# EAGLE design swizzle (EAGLE 6.6.0)
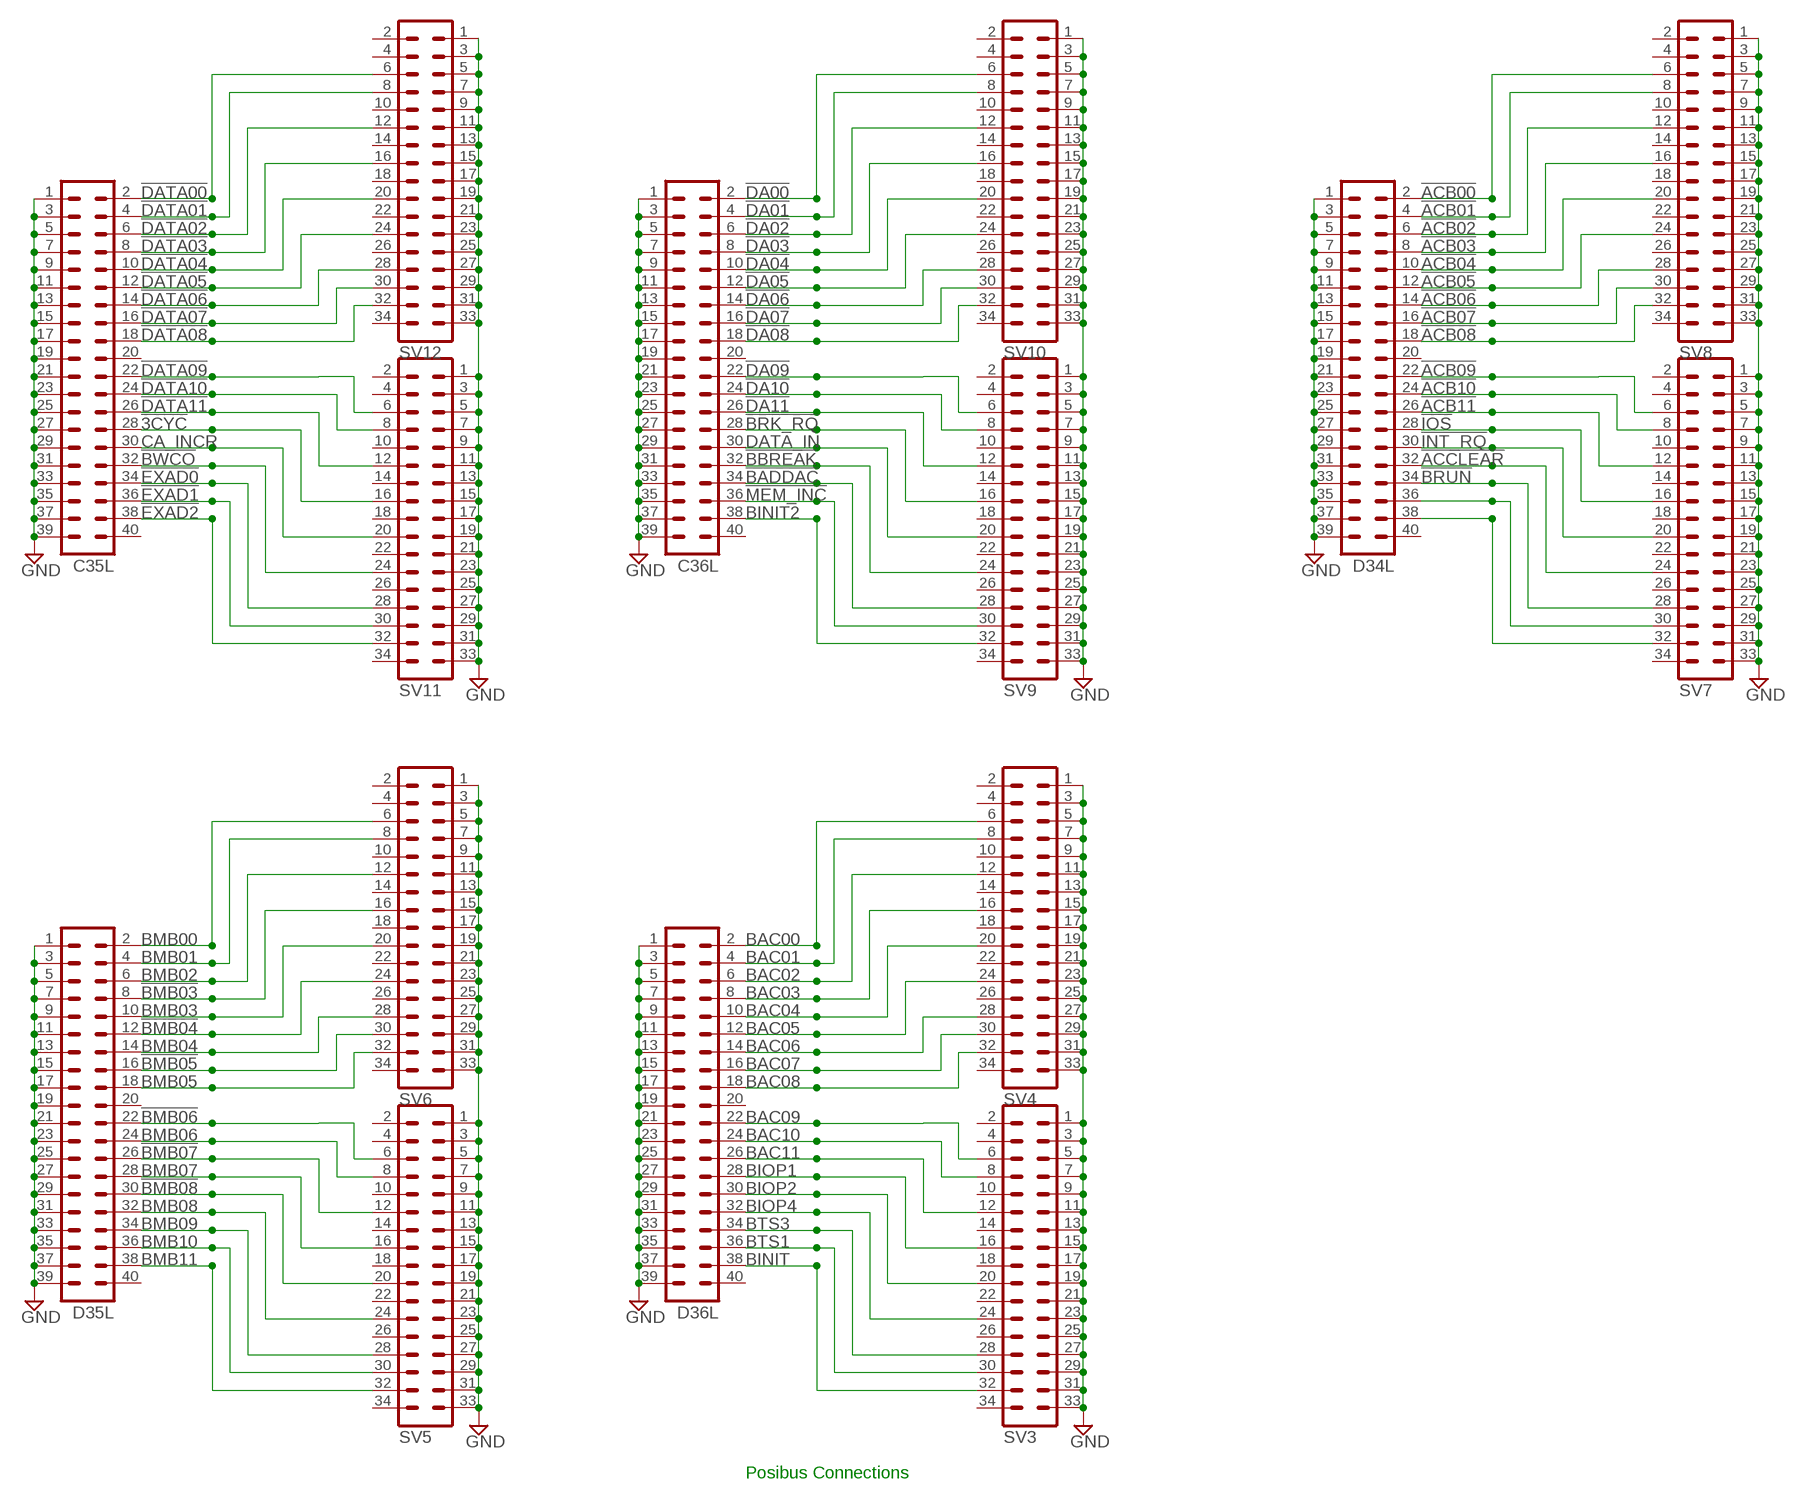
[diagram p0: schematic, sheet 1]

## Parts
C35L  MA20-2  [MA20-2]
C36L  MA20-2  [MA20-2]
D34L  MA20-2  [MA20-2]
D35L  MA20-2  [MA20-2]
D36L  MA20-2  [MA20-2]
SV3  MA17-2  [MA17-2]
SV4  MA17-2  [MA17-2]
SV5  MA17-2  [MA17-2]
SV6  MA17-2  [MA17-2]
SV7  MA17-2  [MA17-2]
SV8  MA17-2  [MA17-2]
SV9  MA17-2  [MA17-2]
SV10  MA17-2  [MA17-2]
SV11  MA17-2  [MA17-2]
SV12  MA17-2  [MA17-2]

## Nets
!3CYC: C35L.28 SV11.16
!ACB00: D34L.2 SV8.6
!ACB01: D34L.4 SV8.8
!ACB02: D34L.6 SV8.12
!ACB03: D34L.8 SV8.16
!ACB04: D34L.10 SV8.20
!ACB05: D34L.12 SV8.24
!ACB06: D34L.14 SV8.28
!ACB07: D34L.16 SV8.30
!ACB08: D34L.18 SV8.32
!ACB09: D34L.22 SV7.6
!ACB10: D34L.24 SV7.8
!ACB11: D34L.26 SV7.12
!ACCLEAR: D34L.32 SV7.24
!BADDAC: C36L.34 SV9.28
!BBREAK: C36L.32 SV9.24
!BMB03: D35L.8 SV6.16
!BMB04: D35L.12 SV6.24
!BMB05: D35L.16 SV6.30
!BMB06: D35L.22 SV5.6
!BMB07: D35L.26 SV5.12
!BMB08: D35L.30 SV5.20
!BRK_RQ: C36L.28 SV9.16
!BRUN: D34L.34 SV7.28
!BWCO: C35L.32 SV11.24
!DA00: C36L.2 SV10.6
!DA01: C36L.4 SV10.8
!DA02: C36L.6 SV10.12
!DA03: C36L.8 SV10.16
!DA04: C36L.10 SV10.20
!DA05: C36L.12 SV10.24
!DA06: C36L.14 SV10.28
!DA07: C36L.16 SV10.30
!DA08: C36L.18 SV10.32
!DA09: C36L.22 SV9.6
!DA10: C36L.24 SV9.8
!DA11: C36L.26 SV9.12
!DATA00: C35L.2 SV12.6
!DATA01: C35L.4 SV12.8
!DATA02: C35L.6 SV12.12
!DATA03: C35L.8 SV12.16
!DATA04: C35L.10 SV12.20
!DATA05: C35L.12 SV12.24
!DATA06: C35L.14 SV12.28
!DATA07: C35L.16 SV12.30
!DATA08: C35L.18 SV12.32
!DATA09: C35L.22 SV11.6
!DATA10: C35L.24 SV11.8
!DATA11: C35L.26 SV11.12
!EXAD0: C35L.34 SV11.28
!EXAD1: C35L.36 SV11.30
!EXAD2: C35L.38 SV11.32
!INT_RQ: D34L.30 SV7.20
!IOS: D34L.28 SV7.16
!MEM_INC: C36L.36 SV9.30
BAC00: D36L.2 SV4.6
BAC01: D36L.4 SV4.8
BAC02: D36L.6 SV4.12
BAC03: D36L.8 SV4.16
BAC04: D36L.10 SV4.20
BAC05: D36L.12 SV4.24
BAC06: D36L.14 SV4.28
BAC07: D36L.16 SV4.30
BAC08: D36L.18 SV4.32
BAC09: D36L.22 SV3.6
BAC10: D36L.24 SV3.8
BAC11: D36L.26 SV3.12
BINIT: D36L.38 SV3.32
BINIT2: C36L.38 SV9.32
BIOP1: D36L.28 SV3.16
BIOP2: D36L.30 SV3.20
BIOP4: D36L.32 SV3.24
BMB00: D35L.2 SV6.6
BMB01: D35L.4 SV6.8
BMB02: D35L.6 SV6.12
BMB03: D35L.10 SV6.20
BMB04: D35L.14 SV6.28
BMB05: D35L.18 SV6.32
BMB06: D35L.24 SV5.8
BMB07: D35L.28 SV5.16
BMB08: D35L.32 SV5.24
BMB09: D35L.34 SV5.28
BMB10: D35L.36 SV5.30
BMB11: D35L.38 SV5.32
BTS1: D36L.36 SV3.30
BTS3: D36L.34 SV3.28
CA_INCR: C35L.30 SV11.20
DATA_IN: C36L.30 SV9.20
GND: C35L.1 C35L.3 C35L.5 C35L.7 C35L.9 C35L.11 C35L.13 C35L.15 C35L.17 C35L.19 C35L.21 C35L.23 C35L.25 C35L.27 C35L.29 C35L.31 C35L.33 C35L.35 C35L.37 C35L.39 C36L.1 C36L.3 C36L.5 C36L.7 C36L.9 C36L.11 C36L.13 C36L.15 C36L.17 C36L.19 C36L.21 C36L.23 C36L.25 C36L.27 C36L.29 C36L.31 C36L.33 C36L.35 C36L.37 C36L.39 D34L.1 D34L.3 D34L.5 D34L.7 D34L.9 D34L.11 D34L.13 D34L.15 D34L.17 D34L.19 D34L.21 D34L.23 D34L.25 D34L.27 D34L.29 D34L.31 D34L.33 D34L.35 D34L.37 D34L.39 D35L.1 D35L.3 D35L.5 D35L.7 D35L.9 D35L.11 D35L.13 D35L.15 D35L.17 D35L.19 D35L.21 D35L.23 D35L.25 D35L.27 D35L.29 D35L.31 D35L.33 D35L.35 D35L.37 D35L.39 D36L.1 D36L.3 D36L.5 D36L.7 D36L.9 D36L.11 D36L.13 D36L.15 D36L.17 D36L.19 D36L.21 D36L.23 D36L.25 D36L.27 D36L.29 D36L.31 D36L.33 D36L.35 D36L.37 D36L.39 SV3.1 SV3.3 SV3.5 SV3.7 SV3.9 SV3.11 SV3.13 SV3.15 SV3.17 SV3.19 SV3.21 SV3.23 SV3.25 SV3.27 SV3.29 SV3.31 SV3.33 SV4.1 SV4.3 SV4.5 SV4.7 SV4.9 SV4.11 SV4.13 SV4.15 SV4.17 SV4.19 SV4.21 SV4.23 SV4.25 SV4.27 SV4.29 SV4.31 SV4.33 SV5.1 SV5.3 SV5.5 SV5.7 SV5.9 SV5.11 SV5.13 SV5.15 SV5.17 SV5.19 SV5.21 SV5.23 SV5.25 SV5.27 SV5.29 SV5.31 SV5.33 SV6.1 SV6.3 SV6.5 SV6.7 SV6.9 SV6.11 SV6.13 SV6.15 SV6.17 SV6.19 SV6.21 SV6.23 SV6.25 SV6.27 SV6.29 SV6.31 SV6.33 SV7.1 SV7.3 SV7.5 SV7.7 SV7.9 SV7.11 SV7.13 SV7.15 SV7.17 SV7.19 SV7.21 SV7.23 SV7.25 SV7.27 SV7.29 SV7.31 SV7.33 SV8.1 SV8.3 SV8.5 SV8.7 SV8.9 SV8.11 SV8.13 SV8.15 SV8.17 SV8.19 SV8.21 SV8.23 SV8.25 SV8.27 SV8.29 SV8.31 SV8.33 SV9.1 SV9.3 SV9.5 SV9.7 SV9.9 SV9.11 SV9.13 SV9.15 SV9.17 SV9.19 SV9.21 SV9.23 SV9.25 SV9.27 SV9.29 SV9.31 SV9.33 SV10.1 SV10.3 SV10.5 SV10.7 SV10.9 SV10.11 SV10.13 SV10.15 SV10.17 SV10.19 SV10.21 SV10.23 SV10.25 SV10.27 SV10.29 SV10.31 SV10.33 SV11.1 SV11.3 SV11.5 SV11.7 SV11.9 SV11.11 SV11.13 SV11.15 SV11.17 SV11.19 SV11.21 SV11.23 SV11.25 SV11.27 SV11.29 SV11.31 SV11.33 SV12.1 SV12.3 SV12.5 SV12.7 SV12.9 SV12.11 SV12.13 SV12.15 SV12.17 SV12.19 SV12.21 SV12.23 SV12.25 SV12.27 SV12.29 SV12.31 SV12.33
N$46: D34L.36 SV7.30
N$47: D34L.38 SV7.32
Unconnected: C35L.20 C35L.40 C36L.20 C36L.40 D34L.20 D34L.40 D35L.20 D35L.40 D36L.20 D36L.40 SV3.2 SV3.4 SV3.10 SV3.14 SV3.18 SV3.22 SV3.26 SV3.34 SV4.2 SV4.4 SV4.10 SV4.14 SV4.18 SV4.22 SV4.26 SV4.34 SV5.2 SV5.4 SV5.10 SV5.14 SV5.18 SV5.22 SV5.26 SV5.34 SV6.2 SV6.4 SV6.10 SV6.14 SV6.18 SV6.22 SV6.26 SV6.34 SV7.2 SV7.4 SV7.10 SV7.14 SV7.18 SV7.22 SV7.26 SV7.34 SV8.2 SV8.4 SV8.10 SV8.14 SV8.18 SV8.22 SV8.26 SV8.34 SV9.2 SV9.4 SV9.10 SV9.14 SV9.18 SV9.22 SV9.26 SV9.34 SV10.2 SV10.4 SV10.10 SV10.14 SV10.18 SV10.22 SV10.26 SV10.34 SV11.2 SV11.4 SV11.10 SV11.14 SV11.18 SV11.22 SV11.26 SV11.34 SV12.2 SV12.4 SV12.10 SV12.14 SV12.18 SV12.22 SV12.26 SV12.34

## Notes on the sheet
- Posibus Connections

## Library data of the parts
C35L C36L D34L D35L D36L = con-lstb:MA20-2: PIN HEADER; OC_FARNELL: unknown; OC_NEWARK: unknown
SV3-SV12 = con-lstb:MA17-2: PIN HEADER; OC_FARNELL: unknown; OC_NEWARK: unknown

## Board
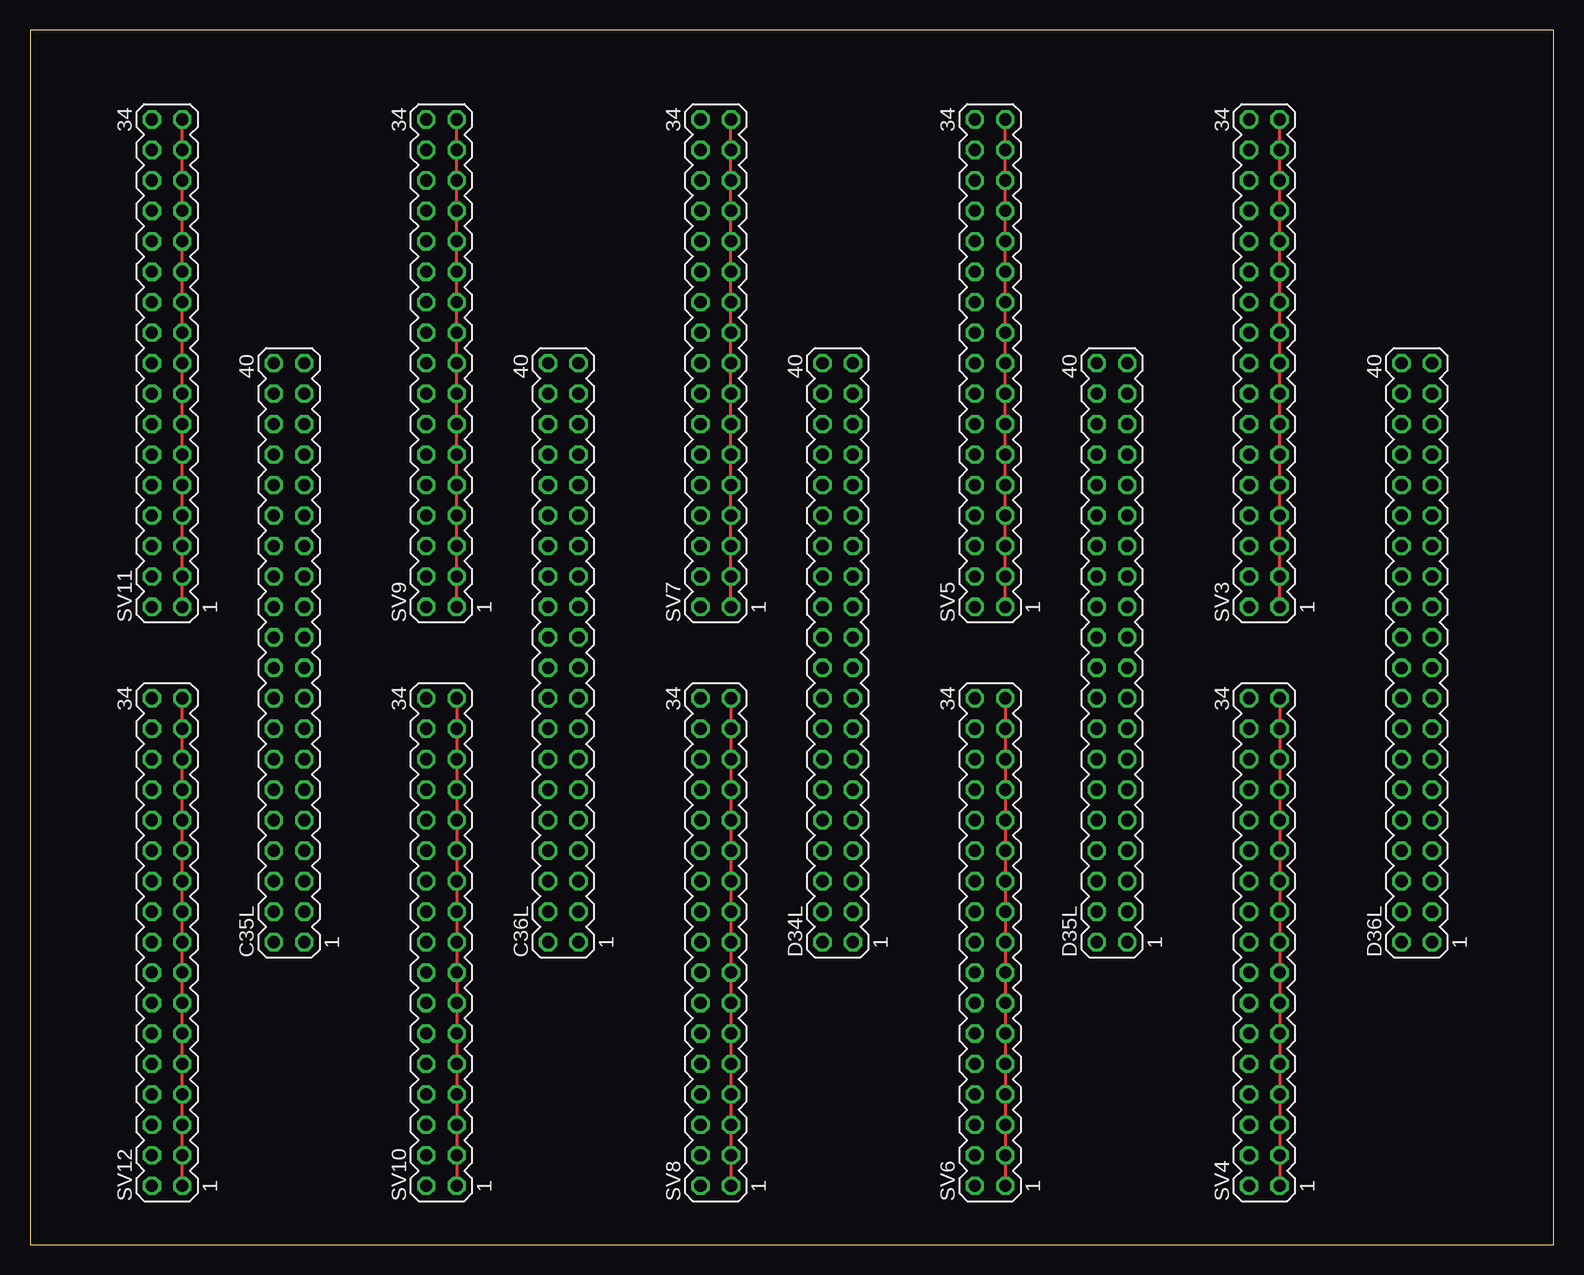
[diagram p1: board, top side]
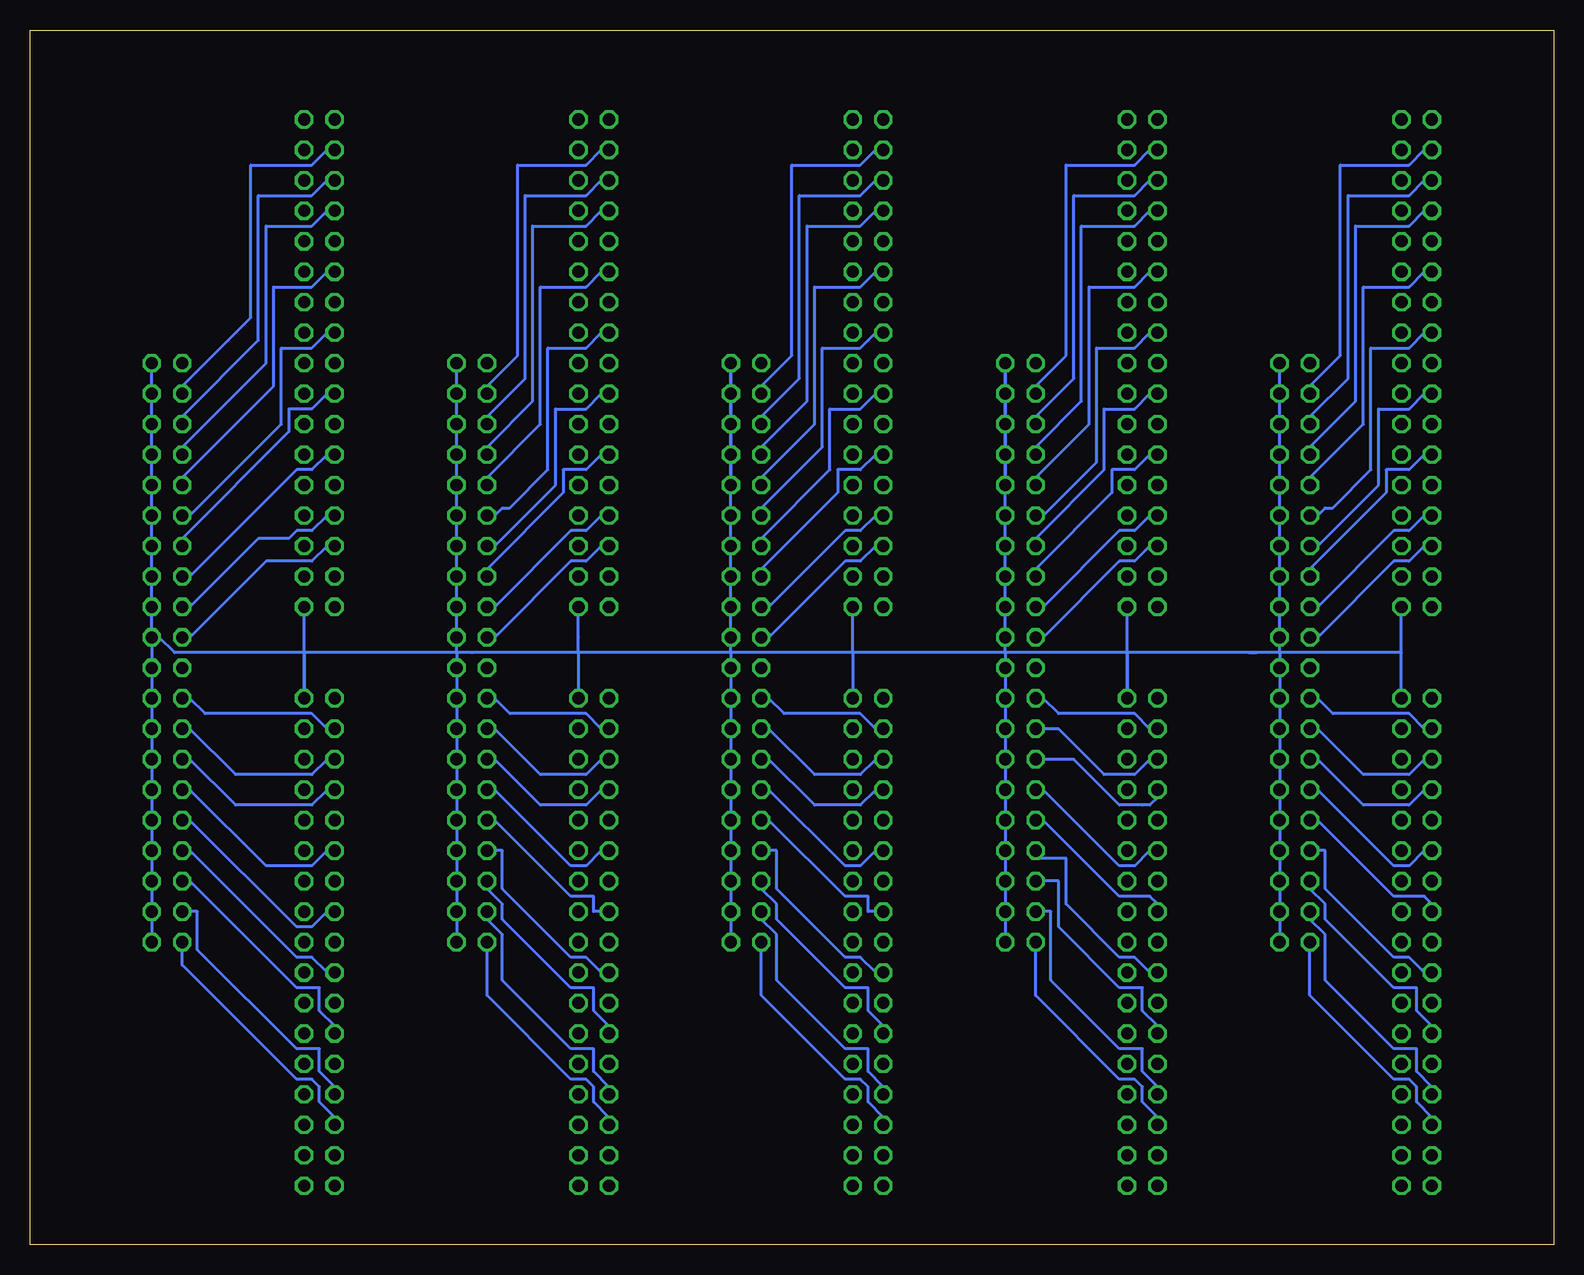
[diagram p2: board, bottom side, seen from below]

Size 126.98 x 101.27 mm. Coordinates in mm from the lower left corner, seen from the top.
Outline: 0,0 126.98,0 126.98,101.27 0,101.27 0,0
Copper layers (1*16): Top 0.035mm / dielectric 1.5mm / Bottom 0.035mm
Design rules "olimex10mil": minimum track width 10mil, minimum drill 24mil, track to track 10mil, track to pad 10mil, pad to pad 10mil, via to via 10mil, smd to smd 10mil, copper to edge 40mil, drill to drill 10mil, minimum pad ring 10mil, minimum via ring 8mil, stop-mask expansion 0mil, vias tented up to drill 0mil, thermal gap 10mil

### Footprints (pad centres in the part's own frame; a part is rotated, then mirrored left to right if it is on the bottom)
MA20-2 = drill 1.016 octagon: 1 -24.13,-1.27; 2 -24.13,1.27; 3 -21.59,-1.27; 4 -21.59,1.27; 5 -19.05,-1.27; 6 -19.05,1.27; 7 -16.51,-1.27; 8 -16.51,1.27; 9 -13.97,-1.27; 10 -13.97,1.27; 11 -11.43,-1.27; 12 -11.43,1.27; 13 -8.89,-1.27; 14 -8.89,1.27; 15 -6.35,-1.27; 16 -6.35,1.27; 17 -3.81,-1.27; 18 -3.81,1.27; 19 -1.27,-1.27; 20 -1.27,1.27; 21 1.27,-1.27; 22 1.27,1.27; 23 3.81,-1.27; 24 3.81,1.27; 25 6.35,-1.27; 26 6.35,1.27; 27 8.89,-1.27; 28 8.89,1.27; 29 11.43,-1.27; 30 11.43,1.27; 31 13.97,-1.27; 32 13.97,1.27; 33 16.51,-1.27; 34 16.51,1.27; 35 19.05,-1.27; 36 19.05,1.27; 37 21.59,-1.27; 38 21.59,1.27; 39 24.13,-1.27; 40 24.13,1.27
MA17-2 = drill 1.016 octagon: 1 -20.32,-1.27; 2 -20.32,1.27; 3 -17.78,-1.27; 4 -17.78,1.27; 5 -15.24,-1.27; 6 -15.24,1.27; 7 -12.7,-1.27; 8 -12.7,1.27; 9 -10.16,-1.27; 10 -10.16,1.27; 11 -7.62,-1.27; 12 -7.62,1.27; 13 -5.08,-1.27; 14 -5.08,1.27; 15 -2.54,-1.27; 16 -2.54,1.27; 17 0,-1.27; 18 0,1.27; 19 2.54,-1.27; 20 2.54,1.27; 21 5.08,-1.27; 22 5.08,1.27; 23 7.62,-1.27; 24 7.62,1.27; 25 10.16,-1.27; 26 10.16,1.27; 27 12.7,-1.27; 28 12.7,1.27; 29 15.24,-1.27; 30 15.24,1.27; 31 17.78,-1.27; 32 17.78,1.27; 33 20.32,-1.27; 34 20.32,1.27

### Placement (x,y rotation side)
C35L  21.59,49.37 90 top
C36L  44.45,49.37 90 top
D34L  67.31,49.37 90 top
D35L  90.17,49.37 90 top
D36L  115.56,49.37 90 top
SV3  102.87,73.49 90 top
SV4  102.87,25.23 90 top
SV5  80.01,73.49 90 top
SV6  80.01,25.23 90 top
SV7  57.14,73.49 90 top
SV8  57.14,25.23 90 top
SV9  34.28,73.49 90 top
SV10  34.28,25.23 90 top
SV11  11.42,73.49 90 top
SV12  11.42,25.23 90 top

### Tracks (layer width: path | path; a pad name or v marks a point on that pad's centre or on a via)
!3CYC
  Bottom 0.254: C35L.28 19.68,58.26 14.6,63.34 14.6,69.68 12.06,69.68 10.79,70.95 SV11.16
!ACB00
  Bottom 0.254: D34L.2 66.04,24.6 66.04,20.79 59.05,13.81 57.78,13.81 57.14,13.17 57.14,11.9 55.88,10.63 SV8.6
!ACB01
  Bottom 0.254: D34L.4 66.04,27.14 64.77,25.87 64.77,22.06 59.05,16.35 57.78,16.35 57.14,16.35 57.14,14.44 55.88,13.17 SV8.8
!ACB02
  Bottom 0.254: SV8.12 55.88,18.25 57.14,19.52 57.14,21.43 59.05,21.43 64.77,27.14 64.77,28.41 66.04,29.68 D34L.6
!ACB03
  Bottom 0.254: SV8.16 56.51,22.7 57.78,23.96 59.05,23.96 64.77,29.68 64.77,32.86 65.4,32.86 D34L.8
!ACB04
  Bottom 0.254: D34L.10 65.4,35.4 59.05,29.05 57.14,29.05 57.14,27.78 56.51,27.78 SV8.20
!ACB05
  Bottom 0.254: D34L.12 65.4,37.94 59.05,31.59 57.78,31.59 56.51,32.86 SV8.24
!ACB06
  Bottom 0.254: D34L.14 65.4,40.48 61.59,36.66 57.78,36.66 56.51,37.94 SV8.28
!ACB07
  Bottom 0.254: D34L.16 65.4,43.02 61.59,39.2 57.78,39.2 56.51,40.48 SV8.30
!ACB08
  Bottom 0.254: SV8.32 56.51,43.02 57.78,44.29 64.13,44.29 65.4,45.55 D34L.18
!ACB09
  Bottom 0.254: SV7.6 56.51,58.26 57.78,56.98 59.05,56.98 65.4,50.63 D34L.22
!ACB10
  Bottom 0.254: SV7.8 56.51,60.8 57.78,59.52 59.05,59.52 65.4,53.18 D34L.24
!ACB11
  Bottom 0.254: D34L.26 66.04,56.35 59.68,62.7 59.68,64.6 57.78,64.6 56.51,65.88 SV7.12
!ACCLEAR
  Bottom 0.254: D34L.32 66.04,63.97 61.59,68.41 61.59,79.84 57.78,79.84 56.51,81.11 SV7.24
!BADDAC
  Bottom 0.254: C36L.34 43.17,66.51 39.36,70.32 39.36,84.92 34.92,84.92 33.65,86.19 SV9.28
!BBREAK
  Bottom 0.254: C36L.32 43.17,63.97 38.73,68.41 38.73,79.84 34.92,79.84 33.65,81.11 SV9.24
!BMB03
  Bottom 0.254: SV6.16 79.37,22.7 80.64,23.96 81.91,23.96 87.62,29.68 87.62,32.86 88.26,32.86 D35L.8
!BMB04
  Bottom 0.254: D35L.12 88.26,37.94 81.91,31.59 80.64,31.59 79.37,32.86 SV6.24
!BMB05
  Bottom 0.254: D35L.16 88.26,43.02 84.45,39.2 80.64,39.2 79.37,40.48 SV6.30
!BMB06
  Bottom 0.254: SV5.6 79.37,58.26 80.64,56.98 81.91,56.98 88.26,50.63 D35L.22
!BMB07
  Bottom 0.254: D35L.26 88.9,56.35 82.55,62.7 82.55,64.6 80.64,64.6 79.37,65.88 SV5.12
!BMB08
  Bottom 0.254: D35L.30 88.26,60.8 87.62,61.43 86.99,61.43 83.81,64.6 83.81,74.77 80.64,74.77 79.37,76.03 SV5.20
!BRK_RQ
  Bottom 0.254: C36L.28 43.17,58.89 37.46,64.6 37.46,69.68 34.92,69.68 33.65,70.95 SV9.16
!BRUN
  Bottom 0.254: D34L.34 66.04,66.51 62.22,70.32 62.22,84.92 57.78,84.92 56.51,86.19 SV7.28
!BWCO
  Bottom 0.254: C35L.32 20.32,63.97 15.87,68.41 15.87,79.84 12.06,79.84 10.79,81.11 SV11.24
!DA00
  Bottom 0.254: C36L.2 43.17,24.6 43.17,20.79 36.19,13.81 34.92,13.81 34.28,13.17 34.28,11.9 33.02,10.63 SV10.6
!DA01
  Bottom 0.254: C36L.4 42.54,27.78 41.9,27.78 41.9,22.06 36.19,16.35 34.92,16.35 34.28,16.35 34.28,14.44 33.02,13.17 SV10.8
!DA02
  Bottom 0.254: SV10.12 33.02,18.25 34.28,19.52 34.28,21.43 36.19,21.43 41.27,26.51 41.27,30.32 42.54,30.32 C36L.6
!DA03
  Bottom 0.254: SV10.16 33.65,22.7 34.92,23.96 36.19,23.96 40.63,28.41 40.63,32.22 43.17,32.22 C36L.8
!DA04
  Bottom 0.254: C36L.10 42.54,35.4 36.19,29.05 34.28,29.05 33.65,29.05 33.02,28.41 SV10.20
!DA05
  Bottom 0.254: C36L.12 42.54,37.94 36.19,31.59 34.92,31.59 33.65,32.86 SV10.24
!DA06
  Bottom 0.254: C36L.14 42.54,40.48 40,40.48 36.19,36.66 34.28,36.66 33.65,36.66 33.02,37.3 SV10.28
!DA07
  Bottom 0.254: C36L.16 42.54,43.02 41.27,43.02 37.46,39.2 34.92,39.2 33.65,40.48 SV10.30
!DA08
  Bottom 0.254: SV10.32 33.65,43.02 34.92,44.29 41.27,44.29 42.54,45.55 C36L.18
!DA09
  Bottom 0.254: SV9.6 33.65,58.26 34.92,56.98 36.19,56.98 42.54,50.63 C36L.22
!DA10
  Bottom 0.254: SV9.8 33.65,60.8 34.92,59.52 36.19,59.52 42.54,53.18 C36L.24
!DA11
  Bottom 0.254: C36L.26 43.17,56.35 36.82,62.7 36.82,64.6 34.92,64.6 33.65,65.88 SV9.12
!DATA00
  Bottom 0.254: C35L.2 20.32,24.6 20.32,20.79 13.33,13.81 12.06,13.81 11.42,13.17 11.42,11.9 10.15,10.63 SV12.6
!DATA01
  Bottom 0.254: C35L.4 20.32,27.14 19.05,25.87 19.05,22.06 13.33,16.35 12.06,16.35 11.42,16.35 11.42,14.44 10.15,13.17 SV12.8
!DATA02
  Bottom 0.254: SV12.12 10.15,18.25 11.42,19.52 11.42,21.43 13.33,21.43 19.05,27.14 19.05,28.41 20.32,29.68 C35L.6
!DATA03
  Bottom 0.254: SV12.16 10.79,22.7 12.06,23.96 13.33,23.96 19.05,29.68 19.05,32.86 19.68,32.86 C35L.8
!DATA04
  Bottom 0.254: C35L.10 19.68,35.4 13.33,29.05 11.42,29.05 10.79,29.05 10.15,28.41 SV12.20
!DATA05
  Bottom 0.254: C35L.12 19.68,37.94 13.33,31.59 12.06,31.59 10.79,32.86 SV12.24
!DATA06
  Bottom 0.254: C35L.14 19.68,40.48 15.87,36.66 12.06,36.66 10.79,37.94 SV12.28
!DATA07
  Bottom 0.254: C35L.16 19.68,43.02 15.87,39.2 12.06,39.2 10.79,40.48 SV12.30
!DATA08
  Bottom 0.254: SV12.32 10.79,43.02 12.06,44.29 18.41,44.29 19.68,45.55 C35L.18
!DATA09
  Bottom 0.254: SV11.6 10.79,58.26 12.06,56.98 13.33,56.98 19.68,50.63 C35L.22
!DATA10
  Bottom 0.254: SV11.8 10.79,60.8 12.06,59.52 13.33,59.52 19.68,53.18 C35L.24
!DATA11
  Bottom 0.254: C35L.26 20.32,56.35 13.96,62.7 13.96,64.6 12.06,64.6 10.79,65.88 SV11.12
!EXAD0
  Bottom 0.254: C35L.34 20.32,66.51 16.51,70.32 16.51,84.92 12.06,84.92 10.79,86.19 SV11.28
!EXAD1
  Bottom 0.254: C35L.36 20.32,69.05 17.14,72.22 17.14,87.46 12.06,87.46 10.79,88.73 SV11.30
!EXAD2
  Bottom 0.254: C35L.38 20.32,71.59 17.78,74.13 17.78,90 12.06,90 10.79,91.27 SV11.32
!INT_RQ
  Bottom 0.254: D34L.30 66.04,61.43 60.95,66.51 60.95,74.77 57.78,74.77 56.51,76.03 SV7.20
!IOS
  Bottom 0.254: D34L.28 66.04,58.89 60.32,64.6 60.32,69.68 57.78,69.68 56.51,70.95 SV7.16
!MEM_INC
  Bottom 0.254: C36L.36 43.17,69.05 40,72.22 40,87.46 34.92,87.46 33.65,88.73 SV9.30
BAC00
  Bottom 0.254: D36L.2 114.3,24.6 114.3,23.33 104.77,13.81 103.5,13.81 102.87,13.17 102.87,11.9 101.59,10.63 SV4.6
BAC01
  Bottom 0.254: D36L.4 113.66,27.78 113.03,27.78 113.03,24.6 104.77,16.35 103.5,16.35 102.87,16.35 102.87,14.44 101.59,13.17 SV4.8
BAC02
  Bottom 0.254: SV4.12 101.59,18.25 102.87,19.52 102.87,21.43 104.77,21.43 113.66,30.32 D36L.6
BAC03
  Bottom 0.254: SV4.16 102.23,22.7 103.5,23.96 104.77,23.96 113.66,32.86 D36L.8
BAC04
  Bottom 0.254: D36L.10 113.66,35.4 104.77,26.51 103.5,26.51 102.23,27.78 SV4.20
BAC05
  Bottom 0.254: D36L.12 113.66,37.94 107.31,31.59 103.5,31.59 102.23,32.86 SV4.24
BAC06
  Bottom 0.254: D36L.14 113.66,40.48 109.85,36.66 103.5,36.66 102.23,37.94 SV4.28
BAC07
  Bottom 0.254: D36L.16 113.66,43.02 109.85,39.2 103.5,39.2 102.23,40.48 SV4.30
BAC08
  Bottom 0.254: SV4.32 102.23,43.02 103.5,44.29 112.39,44.29 113.66,45.55 D36L.18
BAC09
  Bottom 0.254: SV3.6 102.23,58.26 103.5,56.98 107.31,56.98 113.66,50.63 D36L.22
BAC10
  Bottom 0.254: SV3.8 102.23,60.8 103.5,59.52 104.77,59.52 105.41,58.89 107.95,58.89 113.66,53.18 D36L.24 114.3,53.81
BAC11
  Bottom 0.254: SV3.12 102.23,65.88 103.5,64.6 104.77,64.6 113.66,55.72 D36L.26
BINIT
  Bottom 0.254: D36L.38 114.3,71.59 108.58,77.3 108.58,90 103.5,90 102.23,91.27 SV3.32
BINIT2
  Bottom 0.254: C36L.38 43.17,71.59 40.63,74.13 40.63,90 34.92,90 33.65,91.27 SV9.32
BIOP1
  Bottom 0.254: D36L.28 114.3,58.89 105.41,67.78 105.41,69.68 103.5,69.68 102.23,70.95 SV3.16
BIOP2
  Bottom 0.254: D36L.30 113.66,60.8 106.04,68.41 106.04,74.77 103.5,74.77 102.23,76.03 SV3.20
BIOP4
  Bottom 0.254: D36L.32 114.3,63.97 106.68,71.59 106.68,79.84 103.5,79.84 102.23,81.11 SV3.24
BMB00
  Bottom 0.254: D35L.2 88.9,24.6 88.9,20.79 81.91,13.81 80.64,13.81 80.01,13.17 80.01,11.9 78.73,10.63 SV6.6
BMB01
  Bottom 0.254: D35L.4 88.9,27.14 87.62,25.87 87.62,22.06 81.91,16.35 80.64,16.35 80.01,16.35 80.01,14.44 78.73,13.17 SV6.8
BMB02
  Bottom 0.254: SV6.12 78.73,18.25 80.01,19.52 80.01,21.43 81.91,21.43 87.62,27.14 87.62,28.41 88.9,29.68 D35L.6
BMB03
  Bottom 0.254: D35L.10 88.26,35.4 81.91,29.05 80.01,29.05 80.01,27.78 79.37,27.78 SV6.20
BMB04
  Bottom 0.254: D35L.14 88.26,40.48 84.45,36.66 80.64,36.66 79.37,37.94 SV6.28
BMB05
  Bottom 0.254: SV6.32 79.37,43.02 80.64,44.29 86.99,44.29 88.26,45.55 D35L.18
BMB06
  Bottom 0.254: SV5.8 79.37,60.8 80.64,59.52 81.91,59.52 88.26,53.18 D35L.24
BMB07
  Bottom 0.254: D35L.28 88.26,58.26 83.18,63.34 83.18,69.68 80.64,69.68 79.37,70.95 SV5.16
BMB08
  Bottom 0.254: D35L.32 88.9,63.97 84.45,68.41 84.45,79.84 80.64,79.84 79.37,81.11 SV5.24
BMB09
  Bottom 0.254: D35L.34 88.9,66.51 85.09,70.32 85.09,84.92 80.64,84.92 79.37,86.19 SV5.28
BMB10
  Bottom 0.254: D35L.36 88.9,69.05 85.72,72.22 85.72,87.46 80.64,87.46 79.37,88.73 SV5.30
BMB11
  Bottom 0.254: D35L.38 88.9,71.59 86.36,74.13 86.36,90 80.64,90 79.37,91.27 SV5.32
BTS1
  Bottom 0.254: D36L.36 114.3,69.05 107.95,75.4 107.95,87.46 103.5,87.46 102.23,88.73 SV3.30
BTS3
  Bottom 0.254: D36L.34 114.3,66.51 107.31,73.49 107.31,84.92 103.5,84.92 102.23,86.19 SV3.28
CA_INCR
  Bottom 0.254: C35L.30 19.68,60.8 19.05,61.43 18.41,61.43 15.23,64.6 15.23,74.77 12.06,74.77 10.79,76.03 SV11.20
DATA_IN
  Bottom 0.254: C36L.30 42.54,60.8 38.09,65.24 38.09,74.77 34.92,74.77 33.65,76.03 SV9.20
GND
  Top 0.254: SV12.1 SV12.3 SV12.5 SV12.7 SV12.9 SV12.11 SV12.13 SV12.15 SV12.17 SV12.19 SV12.21 SV12.23 SV12.25 SV12.27 SV12.29 SV12.31 SV12.33 | SV11.1 SV11.3 SV11.5 SV11.7 SV11.9 SV11.11 SV11.13 SV11.15 SV11.17 SV11.19 SV11.21 SV11.23 SV11.25 SV11.27 SV11.29 SV11.31 SV11.33 | SV10.1 SV10.3 SV10.5 SV10.7 SV10.9 SV10.11 SV10.13 SV10.15 SV10.17 SV10.19 SV10.21 SV10.23 SV10.25 SV10.27 SV10.29 SV10.31 SV10.33 35.55,46.19 | SV9.1 SV9.3 SV9.5 SV9.7 SV9.9 SV9.11 SV9.13 SV9.15 SV9.17 SV9.19 SV9.21 SV9.23 SV9.25 SV9.27 SV9.29 SV9.31 SV9.33 | SV4.1 SV4.3 SV4.5 SV4.7 SV4.9 SV4.11 SV4.13 SV4.15 SV4.17 SV4.19 SV4.21 SV4.23 SV4.25 SV4.27 SV4.29 SV4.31 SV4.33 104.14,46.19 | SV3.1 SV3.3 SV3.5 SV3.7 SV3.9 SV3.11 SV3.13 SV3.15 SV3.17 SV3.19 SV3.21 SV3.23 SV3.25 SV3.27 SV3.29 SV3.31 SV3.33 | SV8.1 SV8.3 SV8.5 SV8.7 SV8.9 SV8.11 SV8.13 SV8.15 SV8.17 SV8.19 SV8.21 SV8.23 SV8.25 SV8.27 SV8.29 SV8.31 SV8.33 | SV7.1 SV7.3 SV7.5 SV7.7 SV7.9 SV7.11 SV7.13 SV7.15 SV7.17 SV7.19 SV7.21 SV7.23 SV7.25 SV7.27 SV7.29 SV7.31 SV7.33 | SV6.1 SV6.3 SV6.5 SV6.7 SV6.9 SV6.11 SV6.13 SV6.15 SV6.17 SV6.19 SV6.21 SV6.23 SV6.25 SV6.27 SV6.29 SV6.31 SV6.33 | SV5.1 SV5.3 SV5.5 SV5.7 SV5.9 SV5.11 SV5.13 SV5.15 SV5.17 SV5.19 SV5.21 SV5.23 SV5.25 SV5.27 SV5.29 SV5.31 SV5.33
  Bottom 0.254: C35L.1 C35L.3 C35L.5 C35L.7 C35L.9 C35L.11 C35L.13 C35L.15 C35L.17 C35L.19 22.86,49.37 | C35L.39 C35L.37 C35L.35 22.86,66.51 C35L.33 C35L.31 C35L.29 C35L.27 C35L.25 C35L.23 C35L.21 22.86,49.37 | SV12.33 12.69,49.37 | 12.69,49.37 SV11.1 | C36L.1 C36L.3 C36L.5 C36L.7 C36L.9 C36L.11 C36L.13 C36L.15 C36L.17 | C36L.17 C36L.19 45.71,49.37 | 45.71,49.37 C36L.21 C36L.23 C36L.25 C36L.27 C36L.29 C36L.31 C36L.33 C36L.35 C36L.37 C36L.39 45.71,49.37 | 35.55,46.19 SV9.1 | D36L.1 D36L.3 D36L.5 D36L.7 D36L.9 D36L.11 D36L.13 D36L.15 D36L.17 D36L.19 D36L.21 | D36L.21 D36L.23 D36L.25 D36L.27 D36L.29 D36L.31 D36L.33 D36L.35 D36L.37 D36L.39 | 104.14,46.19 SV3.1 | D34L.1 D34L.3 D34L.5 D34L.7 D34L.9 D34L.11 D34L.13 D34L.15 D34L.17 | D34L.17 D34L.19 68.58,49.37 | 68.58,49.37 D34L.21 D34L.23 D34L.25 D34L.27 D34L.29 D34L.31 D34L.33 D34L.35 D34L.37 D34L.39 68.58,49.37 | D35L.1 D35L.3 D35L.5 D35L.7 D35L.9 D35L.11 D35L.13 D35L.15 D35L.17 D35L.19 91.44,49.37 | 91.44,49.37 D35L.21 D35L.23 D35L.25 D35L.27 D35L.29 D35L.31 D35L.33 D35L.35 D35L.37 D35L.39 | 81.28,49.37 SV6.33 | 81.28,49.37 81.28,50.63 SV5.1 | 104.14,49.37 114.93,49.37 116.2,50.63 D36L.21 | 104.14,49.37 104.14,46.19 | 104.14,46.19 SV4.33 103.5,45.55 | D34L.17 69.21,45.55 | C36L.17 46.35,45.55 | 25.39,49.37 35.55,49.37 | 25.39,49.37 24.76,49.37 | 35.55,49.37 45.71,49.37 | 45.71,49.37 58.41,49.37 | 58.41,49.37 68.58,49.37 | 68.58,49.37 81.28,49.37 | 81.28,49.37 90.17,49.37 | 35.55,49.37 35.55,46.19 | 35.55,46.19 SV10.33 | 58.41,49.37 SV8.33 | 58.41,49.37 SV7.1 | 12.69,49.37 22.86,49.37 | 22.86,49.37 25.39,49.37 | 90.17,49.37 91.44,49.37 | 91.44,49.37 104.14,49.37
  Bottom 0.254: 81.28,49.37 90.17,49.37
N$46
  Bottom 0.254: D34L.36 66.04,69.05 62.86,72.22 62.86,87.46 57.78,87.46 56.51,88.73 SV7.30
N$47
  Bottom 0.254: D34L.38 66.04,71.59 63.49,74.13 63.49,90 57.78,90 56.51,91.27 SV7.32